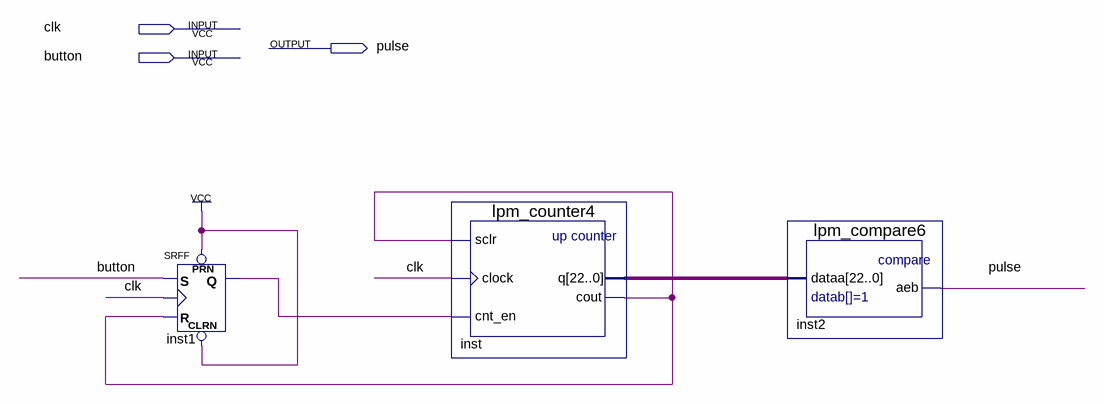
[diagram p0: schematic sheet]
// Quartus schematic g39_singlePulse.bdf as structural Verilog: 3 symbols, 3 pins
module g39_singlePulse (
  input  clk,
  input  button,
  output pulse
);

  wire inst1_q, inst_cout;
  wire [22:0] inst_q;

  SRFF inst1 (.PRN(1'b1), .CLRN(1'b1), .S(button), .R(inst_cout), .CLK(clk), .Q(inst1_q));
  lpm_counter4 inst (.sclr(inst_cout), .clock(clk), .cnt_en(inst1_q), .cout(inst_cout), .q(inst_q));
  lpm_compare6 inst2 (.dataa(inst_q), .aeb(pulse));
endmodule
